# EAGLE schematic small_hopper_board (EAGLE 8.0.1)

## Sheet 1 of 6: Controller
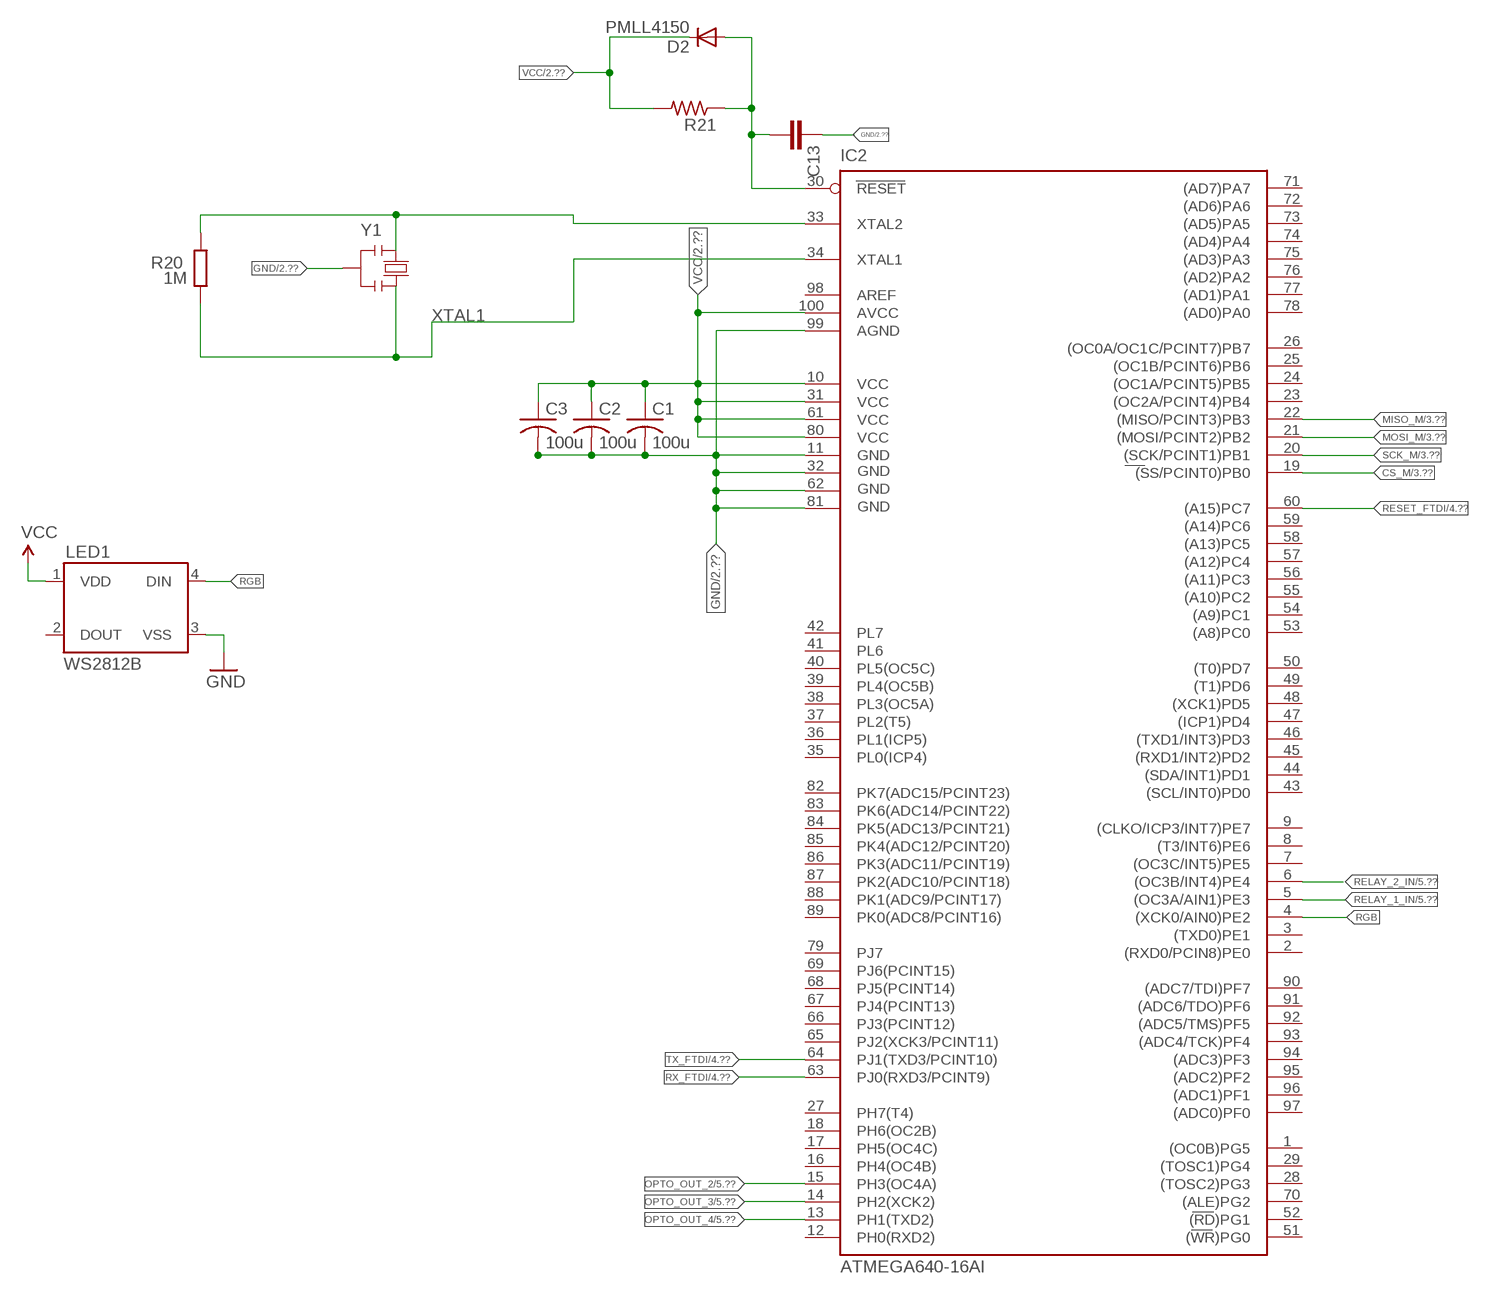
[diagram p0: schematic, sheet 1]

### Parts
C1  100u  C-USC0603  [C0603]
C2  100u  C-USC0603  [C0603]
C3  100u  C-USC0603  [C0603]
C13  CC0603  [C0603]
D2  PMLL4150  [SOD80C]
IC2  ATMEGA640-16AI  [TQFP100]
LED1  WS2812B  [WS2812B]
R20  1M  R-EU_R0603  [R0603-ROUND]
R21  R-US_R0603  [R0603]
Y1  RESONATORMU  [RESONATOR]

### Nets
CS_M: IC2.19((SS/PCINT0)PB0) ; also sheet 3
GND [def]: C1.2 C2.2 C3.2 C13.1 IC2.11(GND) IC2.32(GND1) IC2.62(GND2) IC2.81(GND3) IC2.99(AGND) LED1.3(VSS) Y1.2 ; also sheet 2,3,4,5,6
MISO_M: IC2.22((MISO/PCINT3)PB3) ; also sheet 3
MOSI_M: IC2.21((MOSI/PCINT2)PB2) ; also sheet 3
N$17: C13.2 D2.A IC2.30(RESET) R21.1
OPTO_OUT_2: IC2.15(PH3(OC4A)) ; also sheet 5
OPTO_OUT_3: IC2.14(PH2(XCK2)) ; also sheet 5
OPTO_OUT_4: IC2.13(PH1(TXD2)) ; also sheet 5
RELAY_1_IN: IC2.5((OC3A/AIN1)PE3) ; also sheet 5
RELAY_2_IN: IC2.6((OC3B/INT4)PE4) ; also sheet 5
RESET_FTDI: IC2.60((A15)PC7) ; also sheet 4
RGB: IC2.4((XCK0/AIN0)PE2) LED1.4(DIN)
RX_FTDI: IC2.63(PJ0(RXD3/PCINT9)) ; also sheet 4
SCK_M: IC2.20((SCK/PCINT1)PB1) ; also sheet 3
TX_FTDI: IC2.64(PJ1(TXD3/PCINT10)) ; also sheet 4
VCC [power]: C1.1 C2.1 C3.1 D2.C IC2.10(VCC) IC2.31(VCC1) IC2.61(VCC2) IC2.80(VCC3) IC2.100(AVCC) LED1.1(VDD) R21.2 ; also sheet 2,4,5,6
XTAL1: IC2.34(XTAL1) R20.1 Y1.3
XTAL2: IC2.33(XTAL2) R20.2 Y1.1
Unconnected: IC2.1((OC0B)PG5) IC2.2((RXD0/PCIN8)PE0) IC2.3((TXD0)PE1) IC2.7((OC3C/INT5)PE5) IC2.8((T3/INT6)PE6) IC2.9((CLKO/ICP3/INT7)PE7) IC2.12(PH0(RXD2)) IC2.16(PH4(OC4B)) IC2.17(PH5(OC4C)) IC2.18(PH6(OC2B)) IC2.23((OC2A/PCINT4)PB4) IC2.24((OC1A/PCINT5)PB5) IC2.25((OC1B/PCINT6)PB6) IC2.26((OC0A/OC1C/PCINT7)PB7) IC2.27(PH7(T4)) IC2.28((TOSC2)PG3) IC2.29((TOSC1)PG4) IC2.35(PL0(ICP4)) IC2.36(PL1(ICP5)) IC2.37(PL2(T5)) IC2.38(PL3(OC5A)) IC2.39(PL4(OC5B)) IC2.40(PL5(OC5C)) IC2.41(PL6) IC2.42(PL7) IC2.43((SCL/INT0)PD0) IC2.44((SDA/INT1)PD1) IC2.45((RXD1/INT2)PD2) IC2.46((TXD1/INT3)PD3) IC2.47((ICP1)PD4) IC2.48((XCK1)PD5) IC2.49((T1)PD6) IC2.50((T0)PD7) IC2.51((WR)PG0) IC2.52((RD)PG1) IC2.53((A8)PC0) IC2.54((A9)PC1) IC2.55((A10)PC2) IC2.56((A11)PC3) IC2.57((A12)PC4) IC2.58((A13)PC5) IC2.59((A14)PC6) IC2.65(PJ2(XCK3/PCINT11)) IC2.66(PJ3(PCINT12)) IC2.67(PJ4(PCINT13)) IC2.68(PJ5(PCINT14)) IC2.69(PJ6(PCINT15)) IC2.70((ALE)PG2) IC2.71((AD7)PA7) IC2.72((AD6)PA6) IC2.73((AD5)PA5) IC2.74((AD4)PA4) IC2.75((AD3)PA3) IC2.76((AD2)PA2) IC2.77((AD1)PA1) IC2.78((AD0)PA0) IC2.79(PJ7) IC2.82(PK7(ADC15/PCINT23)) IC2.83(PK6(ADC14/PCINT22)) IC2.84(PK5(ADC13/PCINT21)) IC2.85(PK4(ADC12/PCINT20)) IC2.86(PK3(ADC11/PCINT19)) IC2.87(PK2(ADC10/PCINT18)) IC2.88(PK1(ADC9/PCINT17)) IC2.89(PK0(ADC8/PCINT16)) IC2.90((ADC7/TDI)PF7) IC2.91((ADC6/TDO)PF6) IC2.92((ADC5/TMS)PF5) IC2.93((ADC4/TCK)PF4) IC2.94((ADC3)PF3) IC2.95((ADC2)PF2) IC2.96((ADC1)PF1) IC2.97((ADC0)PF0) IC2.98(AREF) LED1.2(DOUT)

## Sheet 2 of 6: Protection
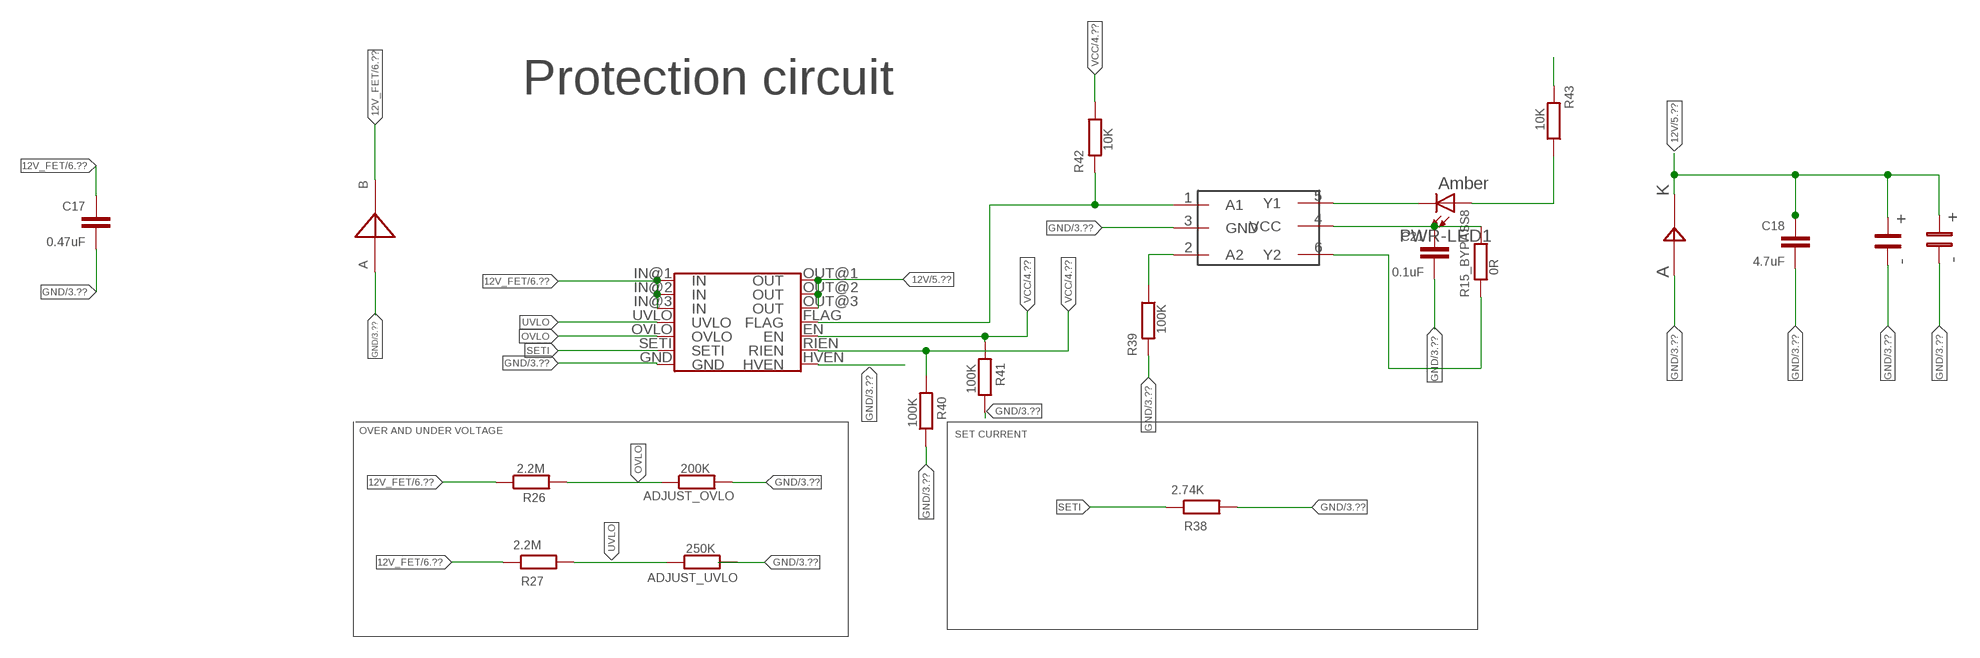
[diagram p1: schematic, sheet 2]

### Parts
ADJUST_OVLO  200K  R-EU_R0603  [R0603-ROUND]
ADJUST_UVLO  250K  R-EU_R0603  [R0603-ROUND]
C17  0.47uF  C-EU0603-RND  [C0603-ROUND]
C18  4.7uF  C-EU0603-RND  [C0603-ROUND]
C21  0.1uF  C-EU0603-RND  [C0603-ROUND]
PWR-LED1  Amber  LED0603  [LED-0603]
R15_BYPASS8  0R  R-EU_R0603  [R0603-ROUND]
R26  2.2M  R-EU_R0603  [R0603-ROUND]
R27  2.2M  R-EU_R0603  [R0603-ROUND]
R38  2.74K  R-EU_R0603  [R0603-ROUND]
R39  100K  R-EU_R0603  [R0603-ROUND]
R40  100K  R-EU_R0603  [R0603-ROUND]
R41  100K  R-EU_R0603  [R0603-ROUND]
R42  10K  R-EU_R0603  [R0603-ROUND]
R43  10K  R-EU_R0603  [R0603-ROUND]
U$37  MAX14571  [TSSOP14]
U$38  STPS5L60S  [SMC]
U$39  SM6T36CA  [DO214AA]
U$40  NC7WZ07P6X  [SC70-6L]
U$41  EEV-FK1H331Q  [EEVFK1H331Q]
U$42  EEV-FK1H331Q  [EEVFK1H331Q]

### Nets
12V: C18.1 U$37.OUT@1(OUT) U$37.OUT@2(OUT) U$37.OUT@3(OUT) U$38.1 U$41.P$2 U$42.P$2 ; also sheet 5,6
12V_FET: C17.1 R26.1 R27.1 U$37.IN@1(IN) U$37.IN@2(IN) U$37.IN@3(IN) U$39.C ; also sheet 6
GND [def]: ADJUST_OVLO.2 ADJUST_UVLO.2 C17.2 C18.2 C21.2 R38.2 R39.2 R40.1 R41.1 U$37.GND U$37.HVEN U$38.2 U$39.A U$40.3(GND) U$41.P$1 U$42.P$1 ; also sheet 1,3,4,5,6
N$40: PWR-LED1.A R43.1
N$45: PWR-LED1.C U$40.5(Y1)
N$46: R39.1 U$40.2(A2)
N$55: R15_BYPASS8.2 U$40.6(Y2)
OVLO: ADJUST_OVLO.1 R26.2 U$37.OVLO
SETI: R38.1 U$37.SETI
UVLO: ADJUST_UVLO.1 R27.2 U$37.UVLO
VCC [power]: C21.1 R15_BYPASS8.1 R40.2 R41.2 R42.1 R43.2 U$37.EN U$37.RIEN U$40.4(VCC) ; also sheet 1,4,5,6
XX: R42.2 U$37.FLAG U$40.1(A1)

### Notes on the sheet
- Protection circuit
- OVER AND UNDER VOLTAGE
- SET CURRENT

## Sheet 3 of 6: Powerstep
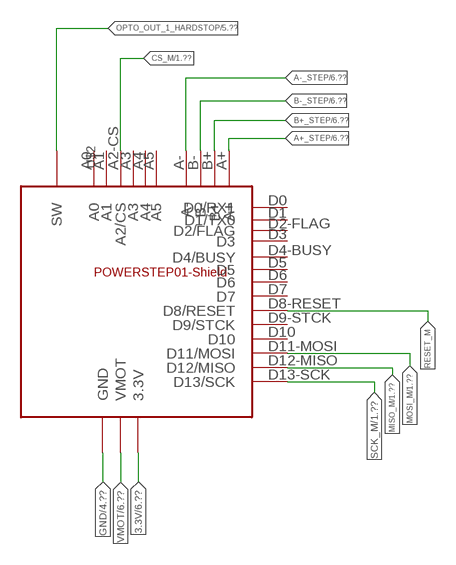
[diagram p2: schematic, sheet 3]

### Parts
U$2  POWERSTEP01-SHIELD  [POWERSTEP1]

### Nets
3.3V [def]: U$2.3.3V U$2.IOREF(3.3V) ; also sheet 6
A+_STEP [V_mot]: U$2.A+ ; also sheet 6
A-_STEP [V_mot]: U$2.A- ; also sheet 6
B+_STEP [V_mot]: U$2.B+ ; also sheet 6
B-_STEP [V_mot]: U$2.B- ; also sheet 6
CS_M: U$2.A2-CS(A2/CS) ; also sheet 1
GND [def]: U$2.GND@0(GND) U$2.GND@1(GND) U$2.GND@2(GND) U$2.GND@3(GND) ; also sheet 1,2,4,5,6
MISO_M: U$2.D12-MISO(D12/MISO) ; also sheet 1
MOSI_M: U$2.D11-MOSI(D11/MOSI) ; also sheet 1
OPTO_OUT_1_HARDSTOP: U$2.SW ; also sheet 5
RESET_M: U$2.D8-RESET(D8/RESET)
SCK_M: U$2.D13-SCK(D13/SCK) ; also sheet 1
VMOT: U$2.VS+(VMOT) ; also sheet 6
Unconnected: U$2.A0 U$2.A1 U$2.A3 U$2.A4 U$2.A5 U$2.D0(D0/RX1) U$2.D1(D1/TX0) U$2.D2-FLAG(D2/FLAG) U$2.D3 U$2.D4-BUSY(D4/BUSY) U$2.D5 U$2.D6 U$2.D7 U$2.D9-STCK(D9/STCK) U$2.D10

## Sheet 4 of 6: FTDI
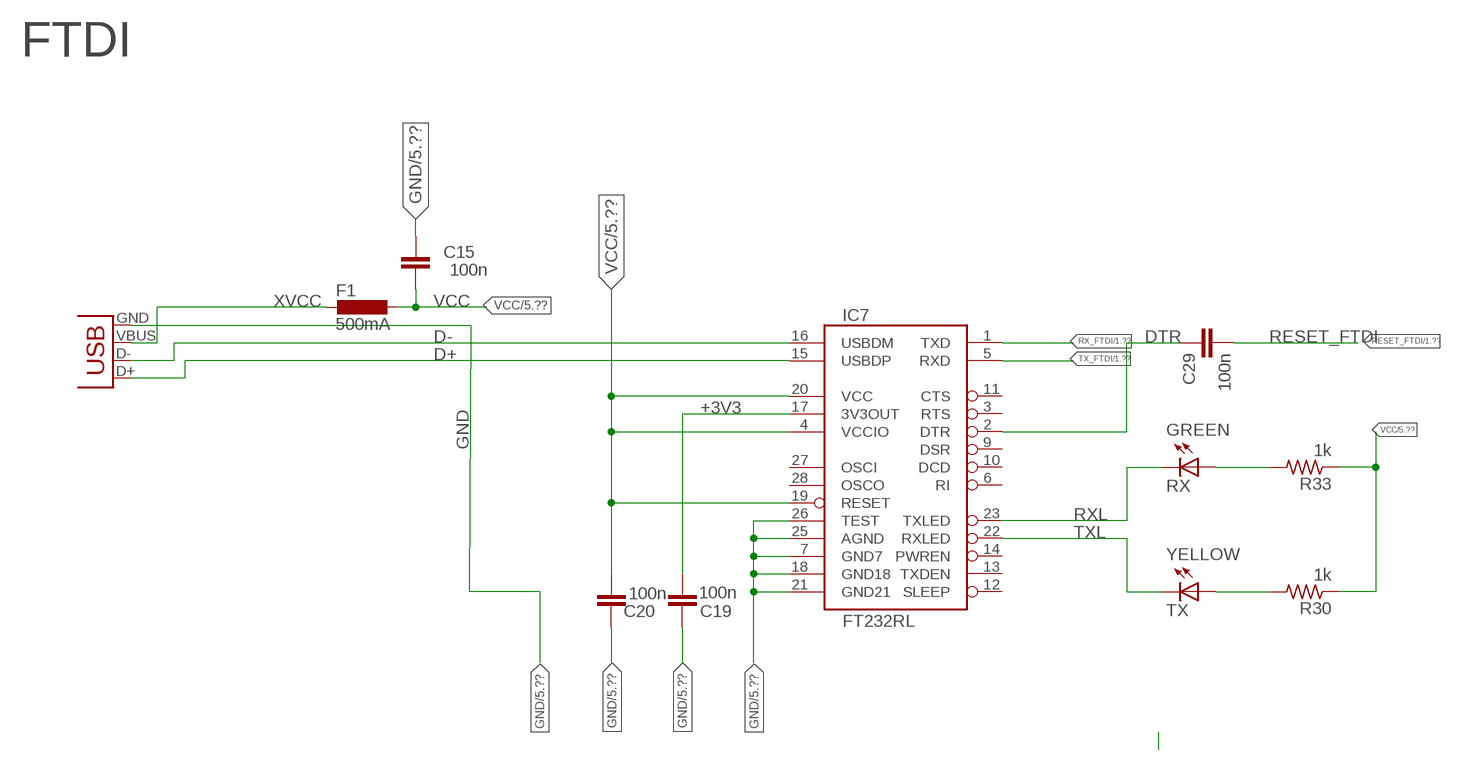
[diagram p3: schematic, sheet 4]

### Parts
C15  100n  C-EUC0603  [C0603]
C19  100n  C-EU0603-RND  [C0603-ROUND]
C20  100n  C-EU0603-RND  [C0603-ROUND]
C29  100n  C-EU0603-RND  [C0603-ROUND]
F1  500mA  L-EUL1812  [L1812]
IC7  FT232RL  FT232RLSSOP  [SSOP28DB]
R30  1k  R-US_R0603  [R0603]
R33  1k  R-US_R0603  [R0603]
RX  GREEN  LEDCHIPLED_0603  [CHIPLED_0603]
TX  YELLOW  LEDCHIPLED_0603  [CHIPLED_0603]
USB  USB  USBPTH-VERTICAL  [USB-B-PTH-VERTICAL]

### Nets
+3V3: C19.2 IC7.17(3V3OUT)
D+: IC7.15(USBDP) USB.D+
D-: IC7.16(USBDM) USB.D-
DTR: C29.1 IC7.2(DTR)
GND [def]: C15.2 C19.1 C20.2 IC7.7(GND7) IC7.18(GND18) IC7.21(GND21) IC7.25(AGND) IC7.26(TEST) USB.GND ; also sheet 1,2,3,5,6
N$3: R30.2 TX.A
N$28: R33.2 RX.A
RESET_FTDI: C29.2 ; also sheet 1
RX_FTDI: IC7.1(TXD) ; also sheet 1
RXL: IC7.23(TXLED) RX.C
TX_FTDI: IC7.5(RXD) ; also sheet 1
TXL: IC7.22(RXLED) TX.C
VCC [power]: C15.1 C20.1 F1.1 IC7.4(VCCIO) IC7.19(RESET) IC7.20(VCC) R30.1 R33.1 ; also sheet 1,2,5,6
XVCC [power]: F1.2 USB.VBUS
Unconnected: IC7.3(RTS) IC7.6(RI) IC7.9(DSR) IC7.10(DCD) IC7.11(CTS) IC7.12(SLEEP) IC7.13(TXDEN) IC7.14(PWREN) IC7.27(OSCI) IC7.28(OSCO)

### Notes on the sheet
- FTDI

## Sheet 5 of 6: IO
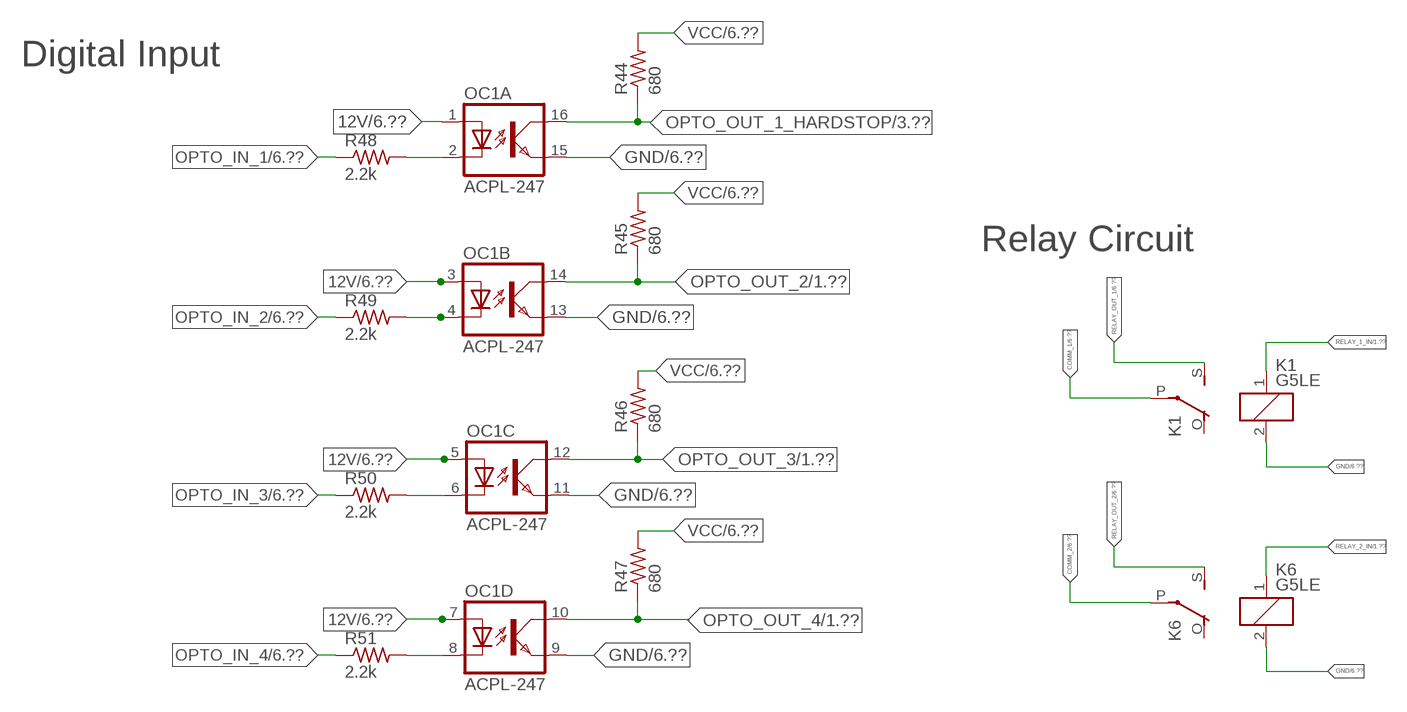
[diagram p4: schematic, sheet 5]

### Parts
K1  G5LE  [G5LE]
K6  G5LE  [G5LE]
OC1  ACPL-247  [SOP16]
R44  680  R-US_R0603  [R0603]
R45  680  R-US_R0603  [R0603]
R46  680  R-US_R0603  [R0603]
R47  680  R-US_R0603  [R0603]
R48  2.2k  R-US_R0603  [R0603]
R49  2.2k  R-US_R0603  [R0603]
R50  2.2k  R-US_R0603  [R0603]
R51  2.2k  R-US_R0603  [R0603]

### Nets
12V: OC1.1(A:A) OC1.3(B:A) OC1.5(C:A) OC1.7(D:A) ; also sheet 2,6
COMM_1: K1.P(2:P) ; also sheet 6
COMM_2: K6.P(2:P) ; also sheet 6
GND [def]: K1.2 K6.2 OC1.9(D:EMIT) OC1.11(C:EMIT) OC1.13(B:EMIT) OC1.15(A:EMIT) ; also sheet 1,2,3,4,6
N$29: OC1.4(B:C) R49.2
N$30: OC1.8(D:C) R51.2
N$31: OC1.6(C:C) R50.2
N$32: OC1.2(A:C) R48.2
OPTO_IN_1: R48.1 ; also sheet 6
OPTO_IN_2: R49.1 ; also sheet 6
OPTO_IN_3: R50.1 ; also sheet 6
OPTO_IN_4: R51.1 ; also sheet 6
OPTO_OUT_1_HARDSTOP: OC1.16(A:COL) R44.1 ; also sheet 3
OPTO_OUT_2: OC1.14(B:COL) R45.1 ; also sheet 1
OPTO_OUT_3: OC1.12(C:COL) R46.1 ; also sheet 1
OPTO_OUT_4: OC1.10(D:COL) R47.1 ; also sheet 1
RELAY_1_IN: K1.1 ; also sheet 1
RELAY_2_IN: K6.1 ; also sheet 1
RELAY_OUT_1: K1.S(2:S) ; also sheet 6
RELAY_OUT_2: K6.S(2:S) ; also sheet 6
VCC [power]: R44.2 R45.2 R46.2 R47.2 ; also sheet 1,2,4,6
Unconnected: K1.O(2:O) K6.O(2:O)

### Notes on the sheet
- Digital Input
- Relay Circuit

## Sheet 6 of 6: Connectors
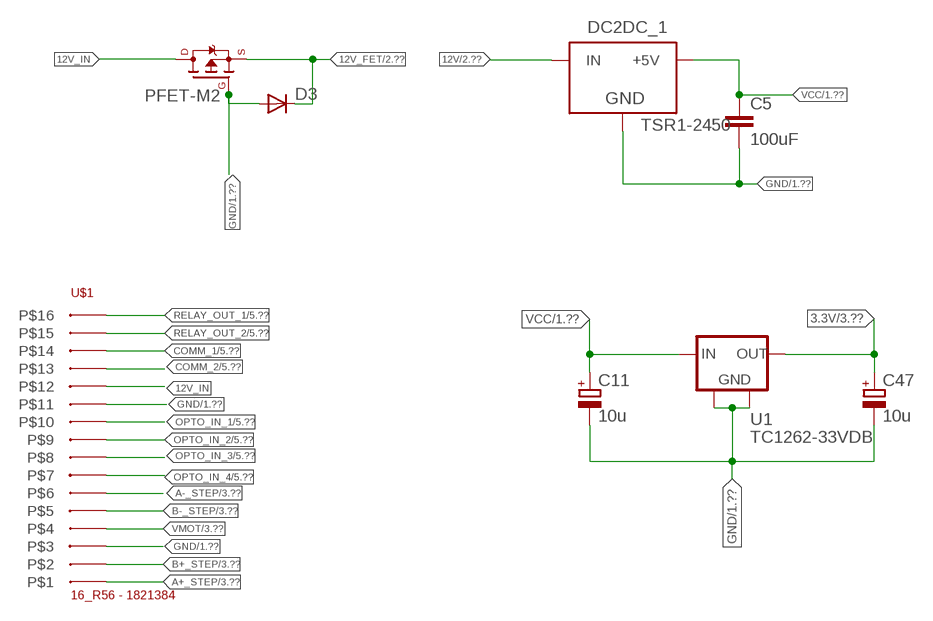
[diagram p5: schematic, sheet 6]

### Parts
C5  100uF  CC0603  [C0603]
C11  10u  CPOL-EU153CLV-0605  [153CLV-0605]
C47  10u  CPOL-EU153CLV-0605  [153CLV-0605]
D3  DIODE-MINIMELF  [MINIMELF]
DC2DC_1  TSR1-2450  [TSR-1]
PFET-M2  FQP47P06NORMAL  [FQP47P06-NORMAL]
U1  TC1262-33VDB  TC1262-50VDB  [SOT223]
U$1  16_R56 - 1821384  [16_R56 - 1821384]

### Nets
3.3V [def]: C47.+ U1.3(OUT) ; also sheet 3
12V: DC2DC_1.1(IN) ; also sheet 2,5
12V_FET: D3.C PFET-M2.3(S) ; also sheet 2
12V_IN: PFET-M2.2(D) U$1.P$12
A+_STEP [V_mot]: U$1.P$1 ; also sheet 3
A-_STEP [V_mot]: U$1.P$6 ; also sheet 3
B+_STEP [V_mot]: U$1.P$2 ; also sheet 3
B-_STEP [V_mot]: U$1.P$5 ; also sheet 3
COMM_1: U$1.P$14 ; also sheet 5
COMM_2: U$1.P$13 ; also sheet 5
GND [def]: C5.2 C11.- C47.- D3.A DC2DC_1.2(GND) PFET-M2.1(G) U1.2(GND) U1.4(GND) U$1.P$3 U$1.P$11 ; also sheet 1,2,3,4,5
OPTO_IN_1: U$1.P$10 ; also sheet 5
OPTO_IN_2: U$1.P$9 ; also sheet 5
OPTO_IN_3: U$1.P$8 ; also sheet 5
OPTO_IN_4: U$1.P$7 ; also sheet 5
RELAY_OUT_1: U$1.P$16 ; also sheet 5
RELAY_OUT_2: U$1.P$15 ; also sheet 5
VCC [power]: C5.1 C11.+ DC2DC_1.3(+5V) U1.1(IN) ; also sheet 1,2,4,5
VMOT: U$1.P$4 ; also sheet 3

## Library data of the parts
ADJUST_OVLO ADJUST_UVLO R15_BYPASS8 R20 R26 R27 R38-R43 = SmartPrj:R-EU_: RESISTOR, European symbol
C1-C3 = rcl:C-US: CAPACITOR, American symbol
C5 C13 = eagle-ltspice:C: CAPACITOR, European symbol; SPICEMODEL: NONE; SPICEPREFIX: C
C11 C47 = resistor:CPOL-EU: POLARIZED CAPACITOR, European symbol
C15 = rcl:C-EU: CAPACITOR, European symbol
C17-C21 C29 = SmartPrj:C-EU: CAPACITOR, European symbol
D2 = diode:PMLL4150: DIODE high speed
D3 = diode:DIODE-: DIODE
DC2DC_1 = SteelCaveRobotics-Power:TSR1-2450: Traco Power TSR 1-2450 5.0v switching regulator
F1 = rcl:L-EU: INDUCTOR, European symbol
IC2 = atmel-2005:ATMEGA*: MICROCONTROLLER 64/128/256 Kbytes FLASH 4 Kbytes EEPROM 8 Kbytes SRAM 86 General Purpose I/O pins 12-channels16-bit PWM 4 x Serial USARTs 16-channels 10-bit A/D
IC7 = SparkFun:FT232RL: USB UART FT232RL 4th Generation USB UART (USB <-> Serial) Controller. Spark Fun Electronics SKU : COM-00650
K1 K6 = relay:G5LE: RELAY 1 x switch, 10 A/120 V AC, 8 A/30 V DC, Omron; OC_FARNELL: unknown; OC_NEWARK: unknown
LED1 = SparkFun-LED:WS2812B: WS2812B - Intelligent control LED integrated light source Technical Specifications: Power Supply Voltage (VDD): 3.5 to 5.3 V Input Voltage (VI): -0.5 to VDD+0.5 V Operating Junction Temperature (Topt): -25°C to +80°C Storage Temperature Range (Tstg): -55°C to +150°C; PROD_ID: DIO-12503
OC1 = avago:ACPL-247
PFET-M2 = FQP47P06:FQP47P06
PWR-LED1 = SparkFun:LED: LEDs Standard schematic elements and footprints for 5mm, 3mm, 1206, and 0603 sized LEDs. 5mm - Spark Fun Electronics SKU : COM-00529 (and others)
R21 R30 R33 = resistor:R-US_: RESISTOR, American symbol
R44-R51 = rcl:R-US_: RESISTOR, American symbol
RX TX = led:LED: LED OSRAM: - CHIPLED LG R971, LG N971, LY N971, LG Q971, LY Q971, LO R971, LY R971 LH N974, LH R974 LS Q976, LO Q976, LY Q976 LO Q996 - Hyper CHIPLED LW Q18S LB Q993, LB Q99A, LB R99A - SideLED LS A670, LO A670, LY A670, LG A670, LP A670 LB A673, LV A673, LT A673, LW A673 LH A674 LY A675 LS A676, LA A676, LO A676, LY A676, LW A676 LS A679, LY A679, LG A679 - Hyper Micro SIDELED® LS Y876, LA Y876, LO Y876, LY Y876 LT Y87S - SmartLED LW L88C, LW L88S LB L89C, LB L89S, LG L890 LS L89K, LO L89K, LY L89K LS L896, LA L896, LO L896, LY L896 - TOPLED LS T670, LO T670, LY T670, LG T670, LP T670 LSG T670, LSP T670, LSY T670, LOP T670, LYG T670 LG T671, LOG T671, LSG T671 LB T673, LV T673, LT T673, LW T673 LH T674 LS T676, LA T676, LO T676, LY T676, LB T676, LH T676, LSB T676, LW T676 LB T67C, LV T67C, LT T67C, LS T67K, LO T67K, LY T67K, LW E67C LS E67B, LA E67B, LO E67B, LY E67B, LB E67C, LV E67C, LT E67C LW T67C LS T679, LY T679, LG T679 LS T770, LO T770, LY T770, LG T770, LP T770 LB T773, LV T773, LT T773, LW T773 LH T774 LS E675, LA E675, LY E675, LS T675 LS T776, LA T776, LO T776, LY T776, LB T776 LHGB T686 LT T68C, LB T68C - Hyper Mini TOPLED® LB M676 - Mini TOPLED Santana® LG M470 LS M47K, LO M47K, LY M47K Source: http://www.osram.convergy.de LUXEON: - LUMILED® LXK2-PW12-R00, LXK2-PW12-S00, LXK2-PW14-U00, LXK2-PW14-V00 LXK2-PM12-R00, LXK2-PM12-S00, LXK2-PM14-U00 LXK2-PE12-Q00, LXK2-PE12-R00, LXK2-PE12-S00, LXK2-PE14-T00, LXK2-PE14-U00 LXK2-PB12-K00, LXK2-PB12-L00, LXK2-PB12-M00, LXK2-PB14-N00, LXK2-PB14-P00, LXK2-PB14-Q00 LXK2-PR12-L00, LXK2-PR12-M00, LXK2-PR14-Q00, LXK2-PR14-R00 LXK2-PD12-Q00, LXK2-PD12-R00, LXK2-PD12-S00 LXK2-PH12-R00, LXK2-PH12-S00 LXK2-PL12-P00, LXK2-PL12-Q00, LXK2-PL12-R00 Source: www.luxeon.com KINGBRIGHT: KA-3528ASYC Source: www.kingbright.com
U1 = v-reg-misc:TC1262
U$1 = Pheonix_connectors:16_R56 - 1821384; PAIR_CON: PN_1821232
U$2 = powerSTEP01-Shield:POWERSTEP01-SHIELD
U$37 = MAX14571:MAX14571
U$38 = STPS5L60S:STPS5L60S
U$39 = ref-packages:SM6T36CA
U$40 = ref-packages:NC7WZ07P6X
U$41 U$42 = EEVFK1H331Q:EEV-FK1H331Q
USB = SparkFun-Connectors:USB: USB Connectors USB-B-PTH is fully proven SKU : PRT-00139/CONN-08278 USB-miniB is fully proven SKU : PRT-00587 USB-A-PCB is untested. USB-A-H is throughly reviewed, but untested. Spark Fun Electronics SKU : PRT-00437 USB-B-SMT is throughly reviewed, but untested. Needs silkscreen touching up. USB-A-S has not been used/tested USB-MB-H has not been used/tested USB-MICROB has been used. CONN-09505
Y1 = SmartPrj:RESONATOR

## Net classes
0 default: width 0.762 mm, drill 0.762 mm, clearance 0.559 mm
1 power: width 0.508 mm, drill 0.406 mm, clearance 0.305 mm
2 V_mot: width 1 mm, drill 0.1 mm, clearance 1 mm
3 def: width 0.254 mm, drill 0.025 mm, clearance 0.254 mm